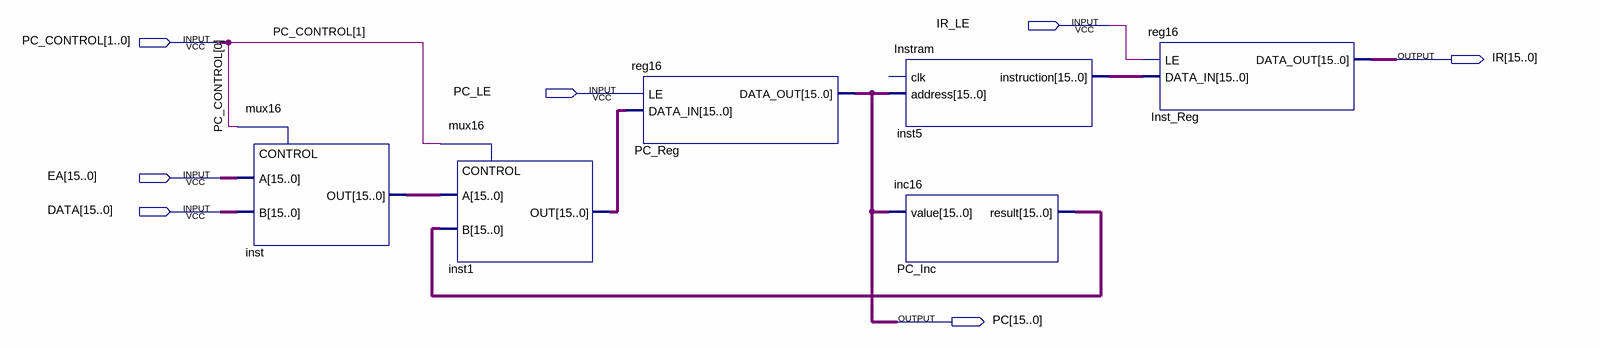
[diagram p0: schematic sheet]
// Quartus schematic Instruction_Fetch.bdf as structural Verilog: 6 symbols, 7 pins
module Instruction_Fetch (
  input  IR_LE,
  input  [1:0] PC_CONTROL,
  input  PC_LE,
  input  [15:0] EA,
  input  [15:0] DATA,
  output [15:0] IR,
  output [15:0] PC
);

  wire [15:0] inst1_out, inst5_instruction, inst_out, PC_Inc_result;

  mux16 inst (.A(EA), .B(DATA), .CONTROL(PC_CONTROL[0]), .OUT(inst_out));
  mux16 inst1 (.A(inst_out), .B(PC_Inc_result), .CONTROL(PC_CONTROL[1]), .OUT(inst1_out));
  reg16 PC_Reg (.LE(PC_LE), .DATA_IN(inst1_out), .DATA_OUT(PC));
  Instram inst5 (.address(PC), .instruction(inst5_instruction));  // open: clk
  inc16 PC_Inc (.value(PC), .result(PC_Inc_result));
  reg16 Inst_Reg (.LE(IR_LE), .DATA_IN(inst5_instruction), .DATA_OUT(IR));
endmodule
